# Altium schematic sheet 超级电容.SchDoc
size A3
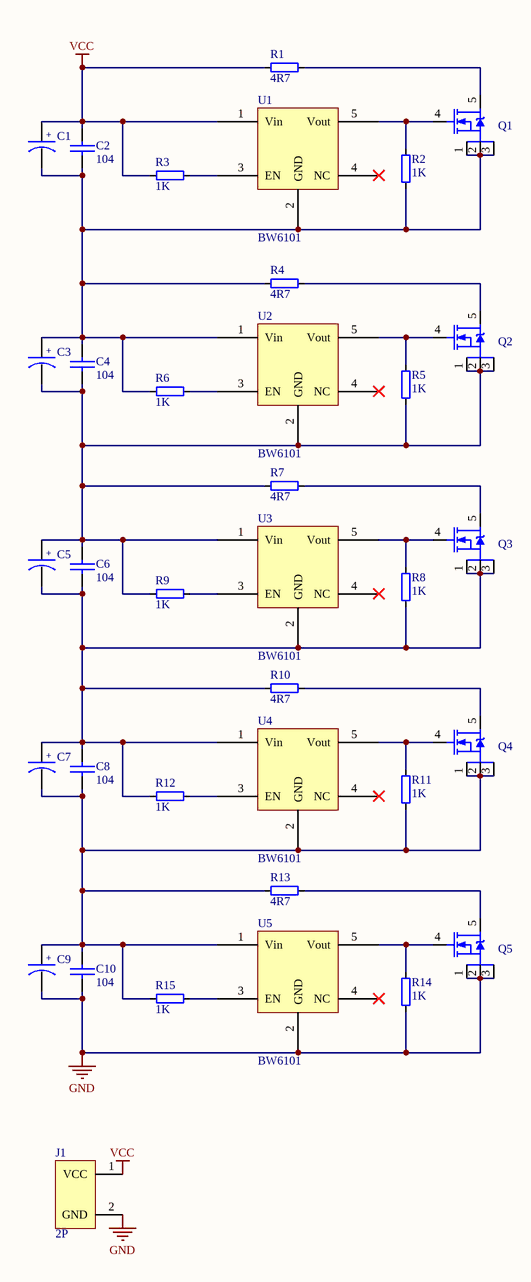
[diagram p0: 超级电容.SchDoc]

## Parts
C1  BCAP0025  [BCAP0025]  (value not drawn)
C2  104  [C0603]
C3  BCAP0025  [BCAP0025]  (value not drawn)
C4  104  [C0603]
C5  BCAP0025  [BCAP0025]  (value not drawn)
C6  104  [C0603]
C7  BCAP0025  [BCAP0025]  (value not drawn)
C8  104  [C0603]
C9  BCAP0025  [BCAP0025]  (value not drawn)
C10  104  [C0603]
J1  2P  [XT30母]
Q1  PSMN1R4-40YLD  [PSMN1R4-40YLD]  (value not drawn)
Q2  PSMN1R4-40YLD  [PSMN1R4-40YLD]  (value not drawn)
Q3  PSMN1R4-40YLD  [PSMN1R4-40YLD]  (value not drawn)
Q4  PSMN1R4-40YLD  [PSMN1R4-40YLD]  (value not drawn)
Q5  PSMN1R4-40YLD  [PSMN1R4-40YLD]  (value not drawn)
R1  4R7  [R2512]
R2  1K  [R0603]
R3  1K  [R0603]
R4  4R7  [R2512]
R5  1K  [R0603]
R6  1K  [R0603]
R7  4R7  [R2512]
R8  1K  [R0603]
R9  1K  [R0603]
R10  4R7  [R2512]
R11  1K  [R0603]
R12  1K  [R0603]
R13  4R7  [R2512]
R14  1K  [R0603]
R15  1K  [R0603]
U1  BW6101  [SOT23-5]
U2  BW6101  [SOT23-5]
U3  BW6101  [SOT23-5]
U4  BW6101  [SOT23-5]
U5  BW6101  [SOT23-5]

## Nets
GND: C9.2 C10.2 J1.2(GND) Q5.1(S) Q5.2(S) Q5.3(S) R14.1 U5.2(GND)
VCC: C1.1 C2.1 J1.1(VCC) R1.1 R3.1 U1.1(Vin)
NetC1_2: C1.2 C2.2 C3.1 C4.1 Q1.1(S) Q1.2(S) Q1.3(S) R2.1 R4.1 R6.1 U1.2(GND) U2.1(Vin)
NetC3_2: C3.2 C4.2 C5.1 C6.1 Q2.1(S) Q2.2(S) Q2.3(S) R5.1 R7.1 R9.1 U2.2(GND) U3.1(Vin)
NetC5_2: C5.2 C6.2 C7.1 C8.1 Q3.1(S) Q3.2(S) Q3.3(S) R8.1 R10.1 R12.1 U3.2(GND) U4.1(Vin)
NetC7_2: C7.2 C8.2 C9.1 C10.1 Q4.1(S) Q4.2(S) Q4.3(S) R11.1 R13.1 R15.1 U4.2(GND) U5.1(Vin)
NetQ1_4: Q1.4(G) R2.2 U1.5(Vout)
NetQ1_5: Q1.5(D) R1.2
NetQ2_4: Q2.4(G) R5.2 U2.5(Vout)
NetQ2_5: Q2.5(D) R4.2
NetQ3_4: Q3.4(G) R8.2 U3.5(Vout)
NetQ3_5: Q3.5(D) R7.2
NetQ4_4: Q4.4(G) R11.2 U4.5(Vout)
NetQ4_5: Q4.5(D) R10.2
NetQ5_4: Q5.4(G) R14.2 U5.5(Vout)
NetQ5_5: Q5.5(D) R13.2
NetR3_2: R3.2 U1.3(EN)
NetR6_2: R6.2 U2.3(EN)
NetR9_2: R9.2 U3.3(EN)
NetR12_2: R12.2 U4.3(EN)
NetR15_2: R15.2 U5.3(EN)

Not connected (* = marked no-connect by the designer): U1 4(NC)*; U2 4(NC)*; U3 4(NC)*; U4 4(NC)*; U5 4(NC)*

## Notes on the sheet
- (in symbol BCAP0025) +

## Library data of the parts
C2 C4 C6 C8 C10 = MLCC
R1-R15 = RES